# EAGLE design Controller (EAGLE 8.4.1)
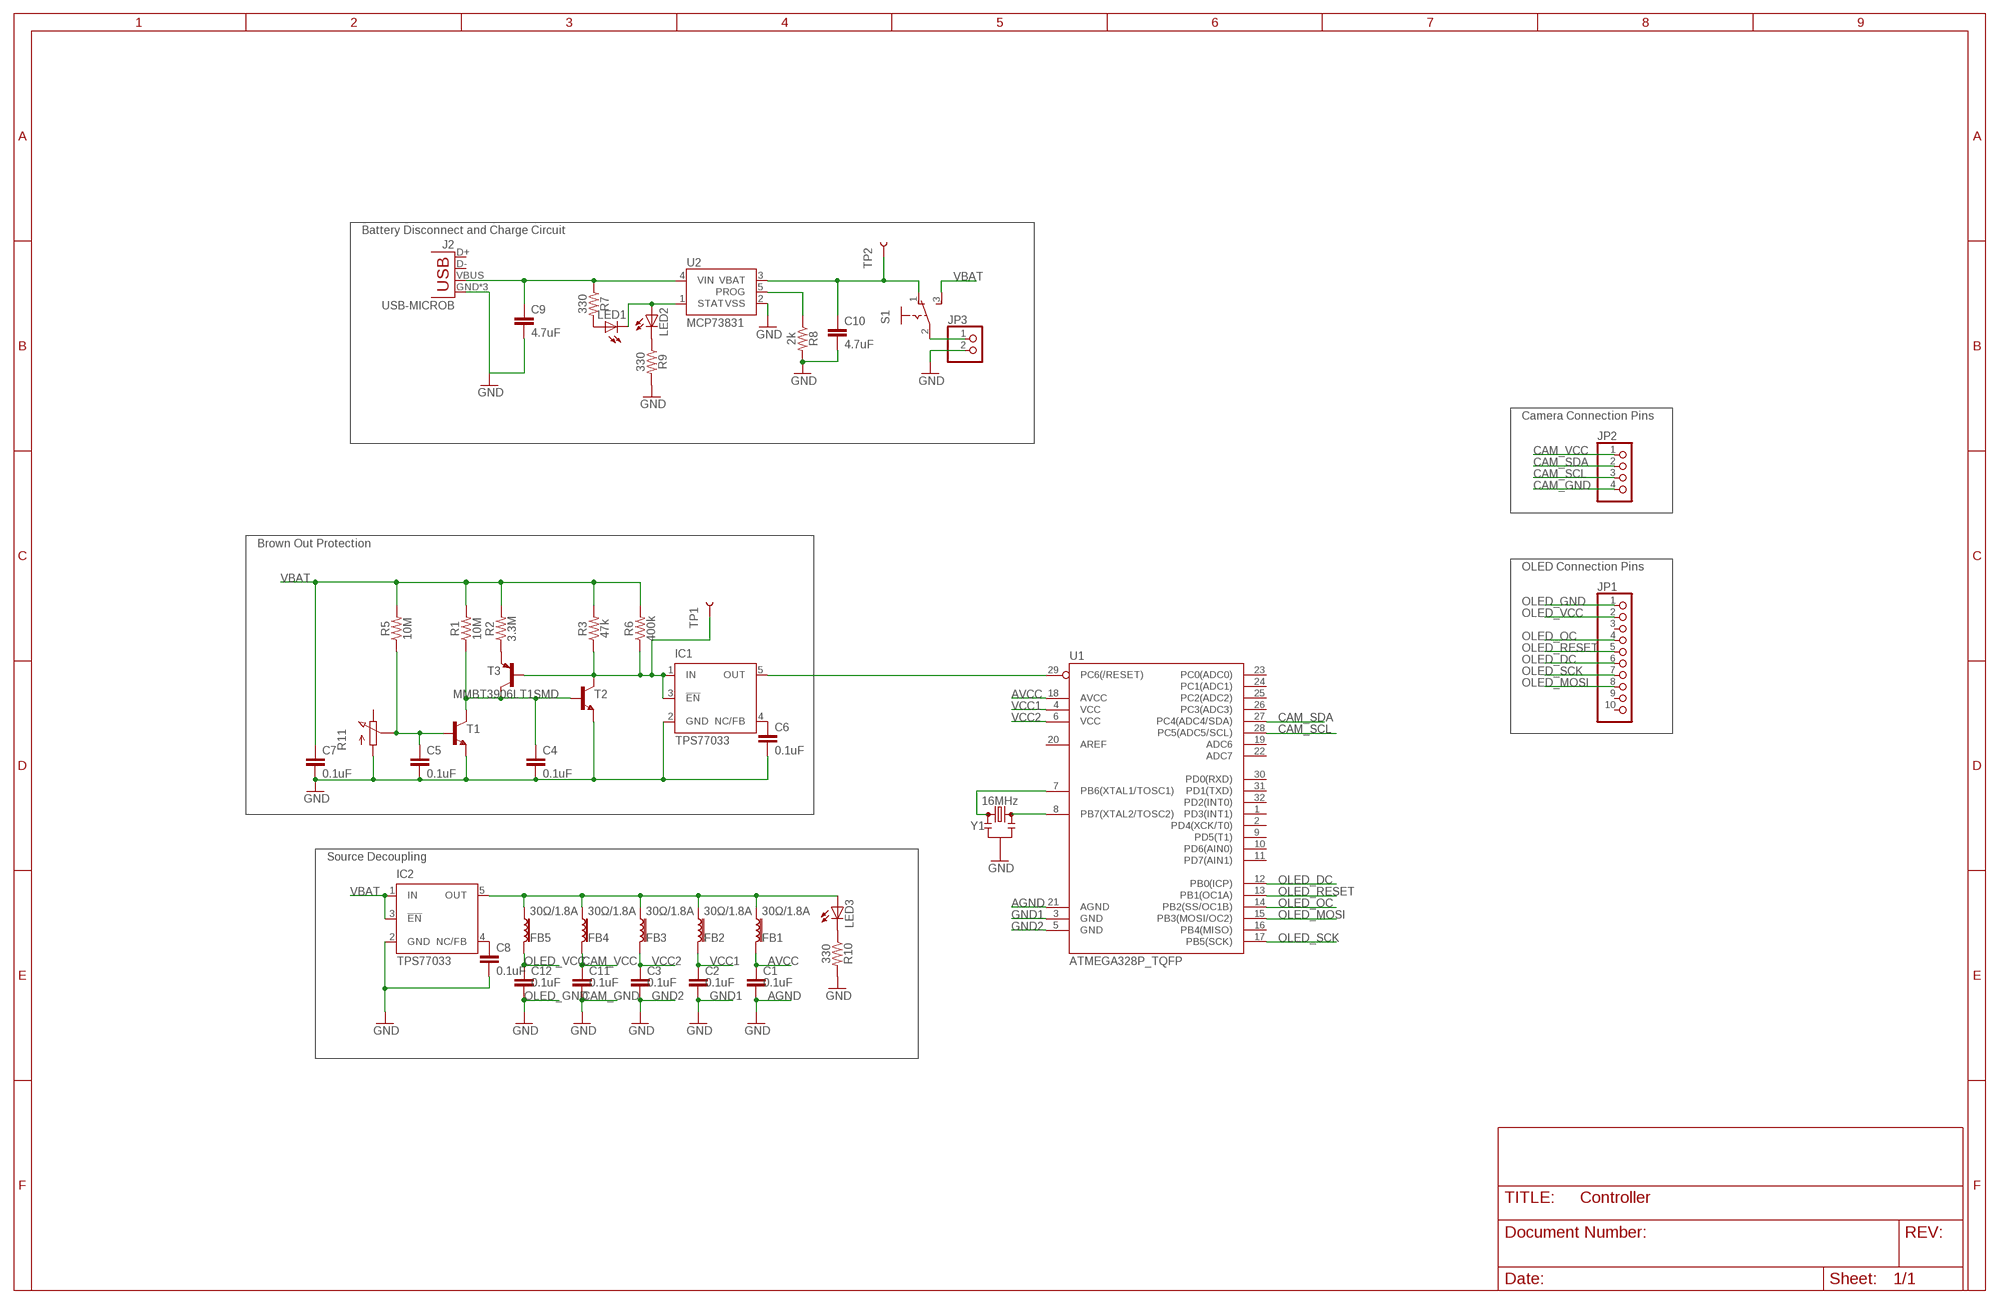
[diagram p0: schematic, sheet 1]

## Parts
C1  0.1uF  0.1UF-0603-25V-5%  [0603]
C2  0.1uF  0.1UF-0603-25V-5%  [0603]
C3  0.1uF  0.1UF-0603-25V-5%  [0603]
C4  0.1uF  0.1UF-0603-25V-5%  [0603]
C5  0.1uF  0.1UF-0603-25V-5%  [0603]
C6  0.1uF  0.1UF-0603-25V-5%  [0603]
C7  0.1uF  0.1UF-0603-25V-5%  [0603]
C8  0.1uF  0.1UF-0603-25V-5%  [0603]
C9  4.7uF  0.1UF-0603-25V-5%  [0603]
C10  4.7uF  0.1UF-0603-25V-5%  [0603]
C11  0.1uF  0.1UF-0603-25V-5%  [0603]
C12  0.1uF  0.1UF-0603-25V-5%  [0603]
FB1  30Ω/1.8A  FERRITE_BEAD-0603  [0603]
FB2  30Ω/1.8A  FERRITE_BEAD-0603  [0603]
FB3  30Ω/1.8A  FERRITE_BEAD-0603  [0603]
FB4  30Ω/1.8A  FERRITE_BEAD-0603  [0603]
FB5  30Ω/1.8A  FERRITE_BEAD-0603  [0603]
IC1  TPS77033  [SOT23-DBV]
IC2  TPS77033  [SOT23-DBV]
J2  USB-MICROB  [USB-MICROB]
JP1  PINHD-1X10/90  [1X10/90]
JP2  PINHD-1X4  [1X04]
JP3  PINHD-1X2/90  [1X02/90]
LED1  LS_T679-D2E2-1  [PLCC2]
LED2  LG_T679-E1F1-1  [PLCC2]
LED3  LG_T679-E1F1-1  [PLCC2]
R1  10M  10MOHM-0603-1/10W-5%  [0603]
R2  3.3M  10MOHM-0603-1/10W-5%  [0603]
R3  47k  10MOHM-0603-1/10W-5%  [0603]
R5  10M  10MOHM-0603-1/10W-5%  [0603]
R6  400k  10MOHM-0603-1/10W-5%  [0603]
R7  330  10MOHM-0603-1/10W-5%  [0603]
R8  2k  10MOHM-0603-1/10W-5%  [0603]
R9  330  10MOHM-0603-1/10W-5%  [0603]
R10  330  10MOHM-0603-1/10W-5%  [0603]
R11  PC25  [PC25]
S1  255SB  [255SB]
T1  MMBT3904LT1-NPN-SOT23-BEC  [SOT23-BEC]
T2  MMBT3904LT1-NPN-SOT23-BEC  [SOT23-BEC]
T3  MMBT3906LT1SMD  [SOT23-BEC]
TP1  TEST-POINT3X5  [PAD.03X.05]
TP2  TEST-POINT3X5  [PAD.03X.05]
U1  ATMEGA328P_TQFP  [TQFP32-08]
U2  MCP73831  [SOT23-5]
Y1  16MHz  RESONATOR-16MHZSMD_3.2X1.3  [RESONATOR-SMD-3.2X1.3]

## Nets
AGND: C1.2 U1.21(AGND) ; supply symbol labelled GND
AVCC: C1.1 FB1.2 U1.18(AVCC)
CAM_GND: C11.2 JP2.4 ; supply symbol labelled GND
CAM_SCL: JP2.3 U1.28(PC5(ADC5/SCL))
CAM_SDA: JP2.2 U1.27(PC4(ADC4/SDA))
CAM_VCC: C11.1 FB4.2 JP2.1
GND: C4.2 C5.2 C6.2 C7.2 C8.2 C9.2 C10.2 IC1.2(GND) IC2.2(GND) J2.GND J2.MT1(GND) J2.MT2(GND) JP3.2 R8.2 R9.2 R10.2 R11.A T1.E T2.E U2.2(VSS) Y1.2
GND1: C2.2 U1.3(GND) ; supply symbol labelled GND
GND2: C3.2 U1.5(GND) ; supply symbol labelled GND
LIPO_POS: JP3.1 S1.2(P)
N$1: IC1.1(IN) IC1.3(!EN) R3.1 R6.1 T2.C T3.B TP1.P$1
N$2: C5.1 R5.1 R11.S T1.B
N$3: IC1.5(OUT) U1.29(PC6(/RESET))
N$4: C4.1 R1.1 T1.C T2.B T3.C
N$5: R2.1 T3.E
N$6: LED1.C LED2.A U2.1(STAT)
N$7: C6.1 IC1.4(NC/FB)
N$8: FB1.1 FB2.1 FB3.1 FB4.1 FB5.1 IC2.5(OUT) LED3.A
N$9: C8.1 IC2.4(NC/FB)
N$10: LED1.A R7.2
N$11: C9.1 J2.VBUS R7.1 U2.4(VIN)
N$12: R8.1 U2.5(PROG)
N$13: C10.1 S1.1(O) TP2.P$1 U2.3(VBAT)
N$15: U1.7(PB6(XTAL1/TOSC1)) Y1.1
N$16: U1.8(PB7(XTAL2/TOSC2)) Y1.3
N$17: LED3.C R10.1
N$18: LED2.C R9.1
OLED_DC: JP1.6 U1.12(PB0(ICP))
OLED_GND: C12.2 JP1.1 ; supply symbol labelled GND
OLED_MOSI: JP1.8 U1.15(PB3(MOSI/OC2))
OLED_OC: JP1.4 U1.14(PB2(SS/OC1B))
OLED_RESET: JP1.5 U1.13(PB1(OC1A))
OLED_SCK: JP1.7 U1.17(PB5(SCK))
OLED_VCC: C12.1 FB5.2 JP1.2
VBAT: C7.1 IC2.1(IN) IC2.3(!EN) R1.2 R2.2 R3.2 R5.2 R6.2 S1.3(S)
VCC1: C2.1 FB2.2 U1.4(VCC)
VCC2: C3.1 FB3.2 U1.6(VCC)
Unconnected: J2.D+ J2.D- JP1.3 JP1.9 JP1.10 R11.E U1.1(PD3(INT1)) U1.2(PD4(XCK/T0)) U1.9(PD5(T1)) U1.10(PD6(AIN0)) U1.11(PD7(AIN1)) U1.16(PB4(MISO)) U1.19(ADC6) U1.20(AREF) U1.22(ADC7) U1.23(PC0(ADC0)) U1.24(PC1(ADC1)) U1.25(PC2(ADC2)) U1.26(PC3(ADC3)) U1.30(PD0(RXD)) U1.31(PD1(TXD)) U1.32(PD2(INT0))

## Notes on the sheet
- Battery Disconnect and Charge Circuit
- Camera Connection Pins
- Brown Out Protection
- OLED Connection Pins
- Source Decoupling

## Library data of the parts
C1-C8 C11 C12 = SparkFun-Capacitors:0.1UF: 0.1µF ceramic capacitors A capacitor is a passive two-terminal electrical component used to store electrical energy temporarily in an electric field.; PROD_ID: CAP-08604
C9 C10 = SparkFun-Capacitors:0.1UF: 0.1µF ceramic capacitors A capacitor is a passive two-terminal electrical component used to store electrical energy temporarily in an electric field.; PROD_ID: CAP-08604; VALUE: 0.1uF
FB1-FB5 = SparkFun-Coils:FERRITE_BEAD: Ferrite Bead (blocks, cores, rings, chokes, etc.) Inductor with layers of ferrite used to suppress high frequencies. Often used to isolate high frequency noise. SparkFun Products: IOIO-OTG - V2.2 <https://www.sparkfun.com/products/13613> SparkFun SAMD21 Mini Breakout <https://www.sparkfun.com/products/13664> SparkFun 6 Degrees of Freedom Breakout - LSM6DS3 <https://www.sparkfun.com/products/13339> SparkFun SAMD21 Dev Breakout <https://www.sparkfun.com/products/13672>; PROD_ID: NDUC-07859
IC1 IC2 = texas:TPS770*: ULTRALOW-POWER 50-mA LOW-DROPOUT LINEAR REGULATORS 50-mA Low-Dropout Regulator Source: http://focus.ti.com/lit/ds/symlink/tps77001.pdf; MF: TEXAS INSTRUMENTS; MPN: TPS77033DBVT; OC_FARNELL: 8461570; OC_NEWARK: 77C1187
J2 = SparkFun-Retired:USB: USB Connectors USB-B-PTH is fully proven SKU : PRT-00139/CONN-08278 USB-miniB is fully proven SKU : PRT-00587 USB-A-PCB is untested. USB-A-H is throughly reviewed, but untested. Spark Fun Electronics SKU : PRT-00437 USB-B-SMT is throughly reviewed, but untested. Needs silkscreen touching up. USB-A-S has not been used/tested USB-MB-H has not been used/tested USB-MICROB has been used. CONN-09505; PROD_ID: CONN-09505
JP1 = pinhead:PINHD-1X10: PIN HEADER
JP2 = pinhead:PINHD-1X4: PIN HEADER
JP3 = pinhead:PINHD-1X2: PIN HEADER
LED1 = led:*_T679-?-1: LC TOPLED® Low Current LED Source: http://catalog.osram-os.com .. LG_LS_LY_T679_OBS.pdf; COLOR: super-red
LED2 LED3 = led:*_T679-?-1: LC TOPLED® Low Current LED Source: http://catalog.osram-os.com .. LG_LS_LY_T679_OBS.pdf; COLOR: green
R1 R5 = SparkFun-Resistors:10MOHM: RES-09327; PROD_ID: RES-08283
R2 R3 R6-R10 = SparkFun-Resistors:10MOHM: RES-09327; PROD_ID: RES-08283; VALUE: 10M
R11 = pot-vitrohm:PC25: VITROHM POTENTIOMETER; MF: CLAROSTAT; MPN: 308NPC25KS; OC_FARNELL: 1440998; OC_NEWARK: 03F7518
S1 = switch:255SB: SLIDING SWITCH Distributor Buerklin, 11G810
T1 T2 = transistor-neu-to92:*-NPN-: NPN Transistror
T3 = transistor-pnp:MMBT3906*: PNP Transistror
TP1 TP2 = SparkFun-Connectors:TEST-POINT: SparkFun Test Points Bare copper test points for troubleshooting or In-Circuit-Testing. These are used by our Production team for verifying production board runs using pogo-pins on test beds. SparkFun Products: SparkFun LSM9DS1 Breakout <https://www.sparkfun.com/products/13284> SparkFun PSOC <https://www.sparkfun.com/products/13714> SparkFun Load Cell Amplifier <https://www.sparkfun.com/products/13879>
U1 = SparkFun-IC-Microcontroller:ATMEGA328P_TQFP: Popular 328P in QFP Storefront component: ATmega328 - TQFP <https://www.sparkfun.com/products/13448> (COM-13448) Datasheet <http://www.sparkfun.com/datasheets/Components/SMD/ATMega328.pdf> SparkFun Products SparkFun RedBoard - Programmed with Arduino <https://www.sparkfun.com/products/12757> (DEV-12757) Arduino Pro Mini 328 - 5V/16MHz <https://www.sparkfun.com/products/11113> (DEV-11113) Arduino Pro Mini 328 - 3.3V/8MHz <https://www.sparkfun.com/products/11114> (DEV-11114) SparkFun OpenLog <https://www.sparkfun.com/products/13712> (DEV-13712) SparkFun MicroView - OLED Arduino Module <https://www.sparkfun.com/products/12923> (DEV-12923) SparkFun Digital Sandbox <https://www.sparkfun.com/products/12651> (DEV-12651) SparkFun PicoBoard <https://www.sparkfun.com/products/11888> (WIG-11888) Arduino Fio <https://www.sparkfun.com/products/10116> (DEV-10116) LilyPad Arduino 328 Main Board <https://www.sparkfun.com/products/13342> (DEV-13342) SparkFun RedStick <https://www.sparkfun.com/products/13741> (DEV-13741) LilyPad MP3 <https://www.sparkfun.com/products/11013> (DEV-11013) LilyPad Arduino SimpleSnap <https://www.sparkfun.com/products/10941> (DEV-10941) SparkFun Stepoko <https://www.sparkfun.com/products/13899> (ROB-13899) SparkFun Geiger Counter <https://www.sparkfun.com/products/11345> (SEN-11345) SparkFun EL Sequencer <https://www.sparkfun.com/products/12781> (COM-12781) Arduino Pro 328 - 5V/16MHz <https://www.sparkfun.com/products/10915> (DEV-10915) CryptoCape <https://www.sparkfun.com/products/12773> (DEV-12773) SparkFun IR Thermometer Evaluation Board - MLX90614 <https://www.sparkfun.com/products/10740> (SEN-10740) SparkFun RedBot Mainboard <https://www.sparkfun.com/products/12097> (ROB-12097) Arduino Pro 328 - 3.3V/8MHz <https://www.sparkfun.com/products/10914> (DEV-10914) SparkFun Block for Intel® Edison - Arduino <https://www.sparkfun.com/products/13036> (DEV-13036) SparkFun Simon Says - Surface Mount Soldering Kit <https://www.sparkfun.com/products/10935> (KIT-10935) SparkFun 7-Segment Serial Display - Red <https://www.sparkfun.com/products/11441> (COM-11441) SparkFun 7-Segment Serial Display - White <https://www.sparkfun.com/products/11629> (COM-11629) SparkFun 7-Segment Serial Display - Yellow <https://www.sparkfun.com/products/11443> (COM-11443) SparkFun 7-Segment Serial Display - Kelly Green <https://www.sparkfun.com/products/11440> (COM-11440) SparkFun 7-Segment Serial Display - Blue <https://www.sparkfun.com/products/11442> (COM-11442) SparkFun OpenSegment Serial Display - 20mm (Blue) <https://www.sparkfun.com/products/11647> (COM-11647) SparkFun OpenSegment Serial Display - 20mm (Green) <https://www.sparkfun.com/products/11646> (COM-11646) SparkFun OpenSegment Serial Display - 20mm (White) <https://www.sparkfun.com/products/11648> (COM-11648) SparkFun OpenSegment Serial Display - 20mm (Red) <https://www.sparkfun.com/products/11644> (COM-11644) SparkFun OpenSegment Serial Display - 20mm (Yellow) <https://www.sparkfun.com/products/11645> (COM-11645) SparkFun OpenSegment Shield <https://www.sparkfun.com/products/13190> (DEV-13190); PROD_ID: IC-09069
U2 = SparkFun-IC-Power:MCP73831: MCP73831T Li-Ion, Li-Pol Controller Miniature single cell, fully integrated Li-Ion, Li-polymer charge management controller Datasheet <http://ww1.microchip.com/downloads/en/DeviceDoc/20001984g.pdf> SparkFun Products: SparkFun ESP32 Thing <https://www.sparkfun.com/products/13907> SparkFun 9DoF Razor IMU M0 <https://www.sparkfun.com/products/14001>; PROD_ID: IC-09995
Y1 = SparkFun-Clocks:RESONATOR-16MHZ: 16MHz Resonator Digikey Example <http://www.digikey.com/product-detail/en/murata-electronics-north-america/CSTCE16M0V53-R0/490-1198-1-ND/584635> Frequency: 16MHz Frequency Stability: ±0.3% Frequency Tolerance: ±0.5% Capacitance: 15pF SparkFun Products SparkFun OpenLog <https://www.sparkfun.com/products/13712> SparkFun MicroView - OLED Arduino Module <https://www.sparkfun.com/products/12923>; PROD_ID: XTAL-08900

## Board
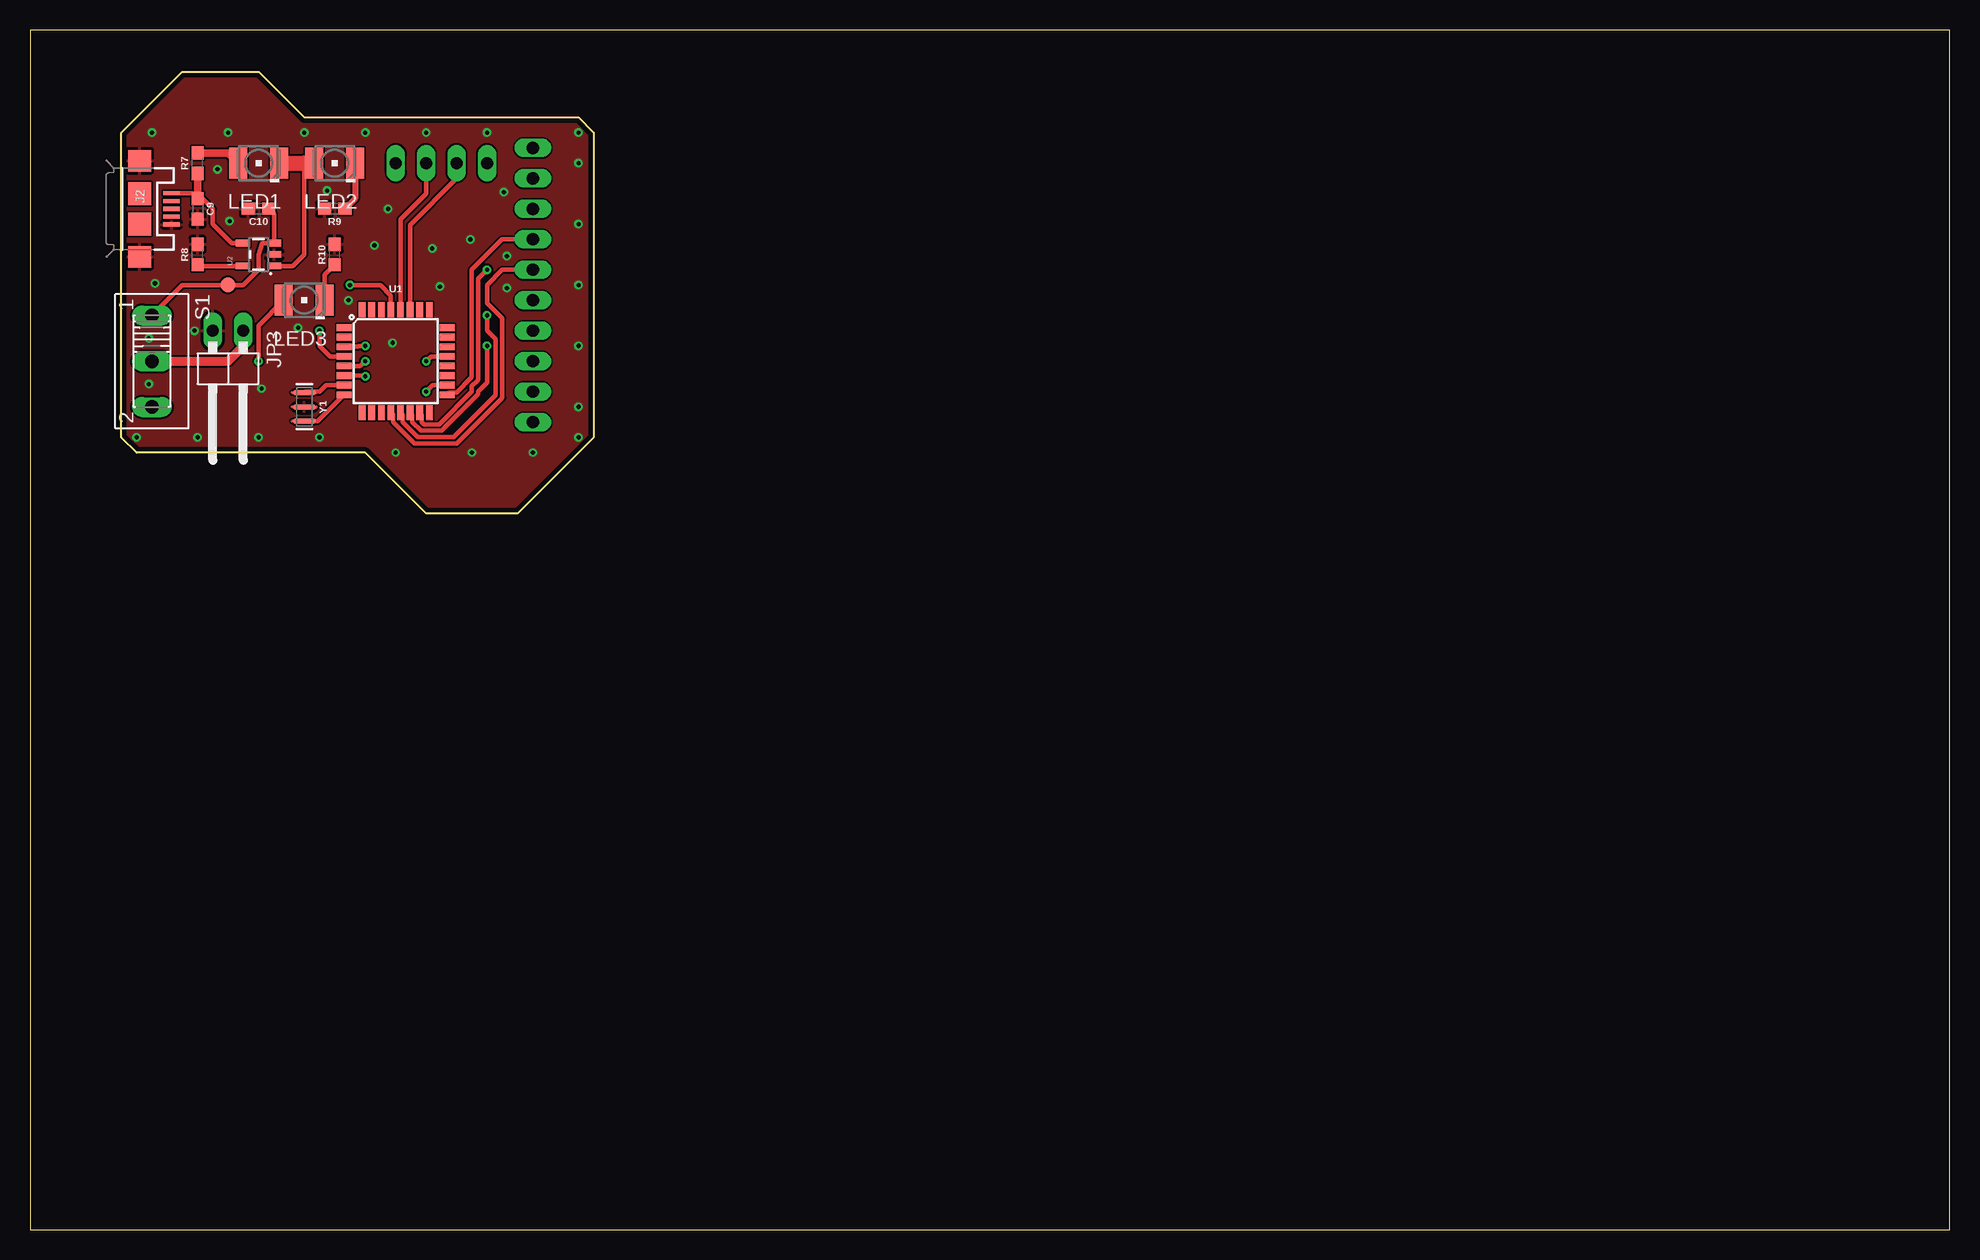
[diagram p1: board, top side]
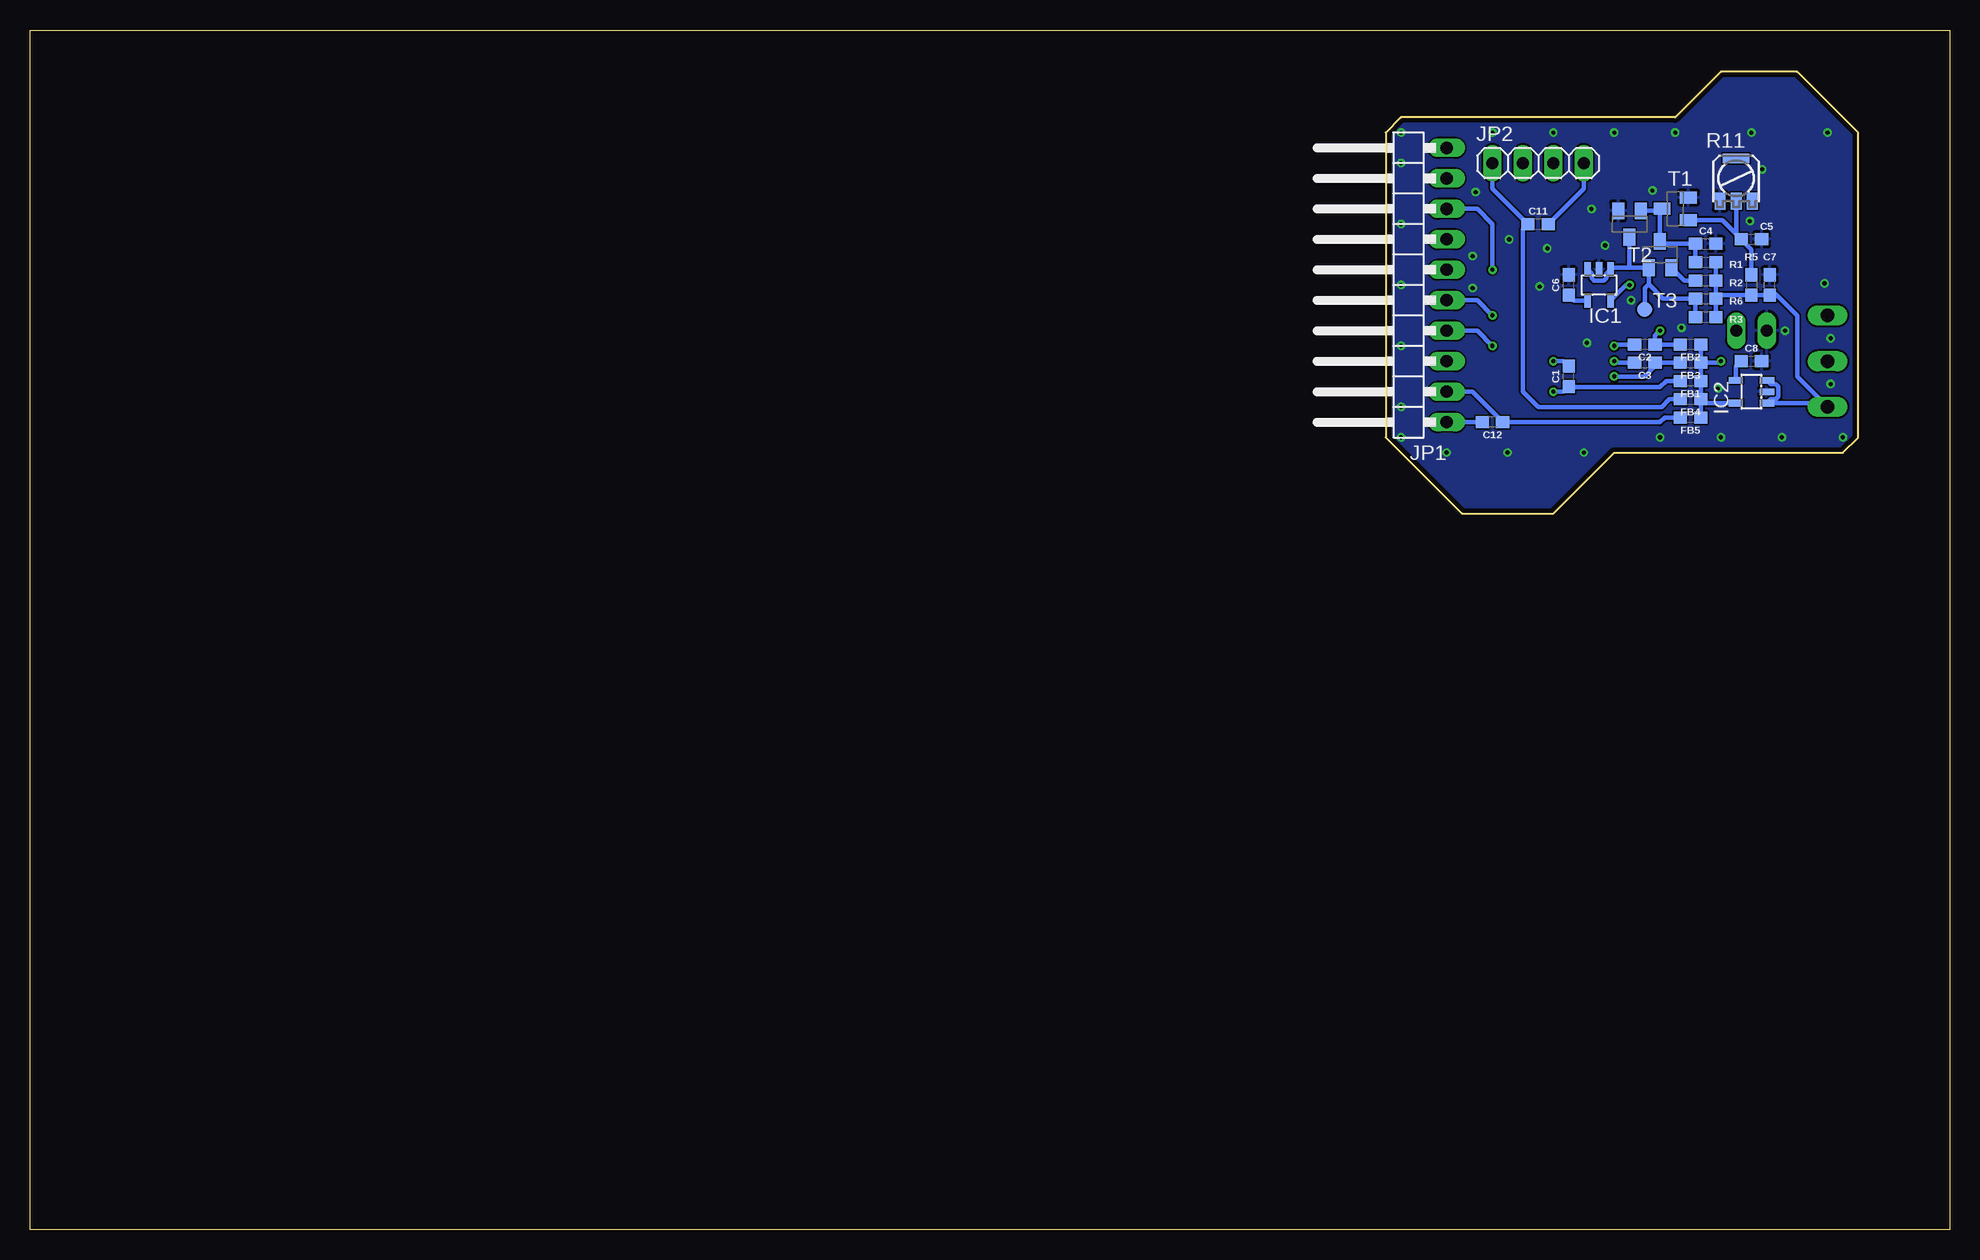
[diagram p2: board, bottom side, seen from below]

Size 160 x 100 mm. Coordinates in mm from the lower left corner, seen from the top.
Outline: 0,0 160,0 160,100 0,100 0,0
Outline: 7.62,91.44 12.7,96.52 19.05,96.52 22.86,92.71 45.72,92.71 46.99,91.44 46.99,66.04 40.64,59.69 33.02,59.69 27.94,64.77 8.89,64.77 7.62,66.04 7.62,91.44
Copper layers (1*16): Top 0.0356mm / dielectric 1.5011mm / Bottom 0.0356mm
Design rules "oshpark-2layer": minimum track width 6mil, minimum drill 13mil, track to track 6mil, track to pad 6mil, pad to pad 6mil, via to via 6mil, smd to smd 6mil, copper to edge 15mil, drill to drill 6mil, minimum pad ring 7mil, minimum via ring 7mil, stop-mask expansion 2.5mil, vias tented up to drill 0mil, thermal gap 10mil

### Footprints (pad centres in the part's own frame; a part is rotated, then mirrored left to right if it is on the bottom)
0603 = smd 1.1 x 1: 1 -0.85,0; 2 0.85,0
SOT23-DBV = smd 0.55 x 1.2: 1 -0.95,-1.3; 2 0,-1.3; 3 0.95,-1.3; 4 0.95,1.3; 5 -0.95,1.3
USB-MICROB = smd 0.35 x 1.4: D+ 0,2.65; D- -0.65,2.65; GND 1.3,2.65; ID 0.65,2.65; VBUS -1.3,2.65 | smd 1.8 x 1.9: MT1 -4,0; MT2 4,0 | smd 1.9 x 1.9: P$1 -1.27,0; P$2 1.27,0
1X10/90 = drill 1.016 long: 1 -11.43,-3.81; 2 -8.89,-3.81; 3 -6.35,-3.81; 4 -3.81,-3.81; 5 -1.27,-3.81; 6 1.27,-3.81; 7 3.81,-3.81; 8 6.35,-3.81; 9 8.89,-3.81; 10 11.43,-3.81
1X04 = drill 1.016 long: 1 -3.81,0; 2 -1.27,0; 3 1.27,0; 4 3.81,0
1X02/90 = drill 1.016 long: 1 -1.27,-3.81; 2 1.27,-3.81
PLCC2 = smd 2.6 x 1.5: A 0,1.7; C 0,-1.7
PC25 = smd 2.2 x 0.8: 4 0,1.65 | smd 0.9 x 1.4: A -1.35,-1.9; E 1.35,-1.9; S 0,-1.9
255SB = drill 1.118 long: 1 -3.81,0; 2 0,0; 3 3.81,0
SOT23-BEC = smd 1 x 1.4: B -0.95,-1.1; C 0,1.1; E 0.95,-1.1
PAD.03X.05 = smd 1.27 x 1.27: P$1 0,0
TQFP32-08 = smd 1.27 x 0.559: 1 -4.293,2.8; 2 -4.293,2; 3 -4.293,1.2; 4 -4.293,0.4; 5 -4.293,-0.4; 6 -4.293,-1.2; 7 -4.293,-2; 8 -4.293,-2.8; 17 4.293,-2.8; 18 4.293,-2; 19 4.293,-1.2; 20 4.293,-0.4; 21 4.293,0.4; 22 4.293,1.2; 23 4.293,2; 24 4.293,2.8 | smd 0.559 x 1.27: 9 -2.8,-4.293; 10 -2,-4.293; 11 -1.2,-4.293; 12 -0.4,-4.293; 13 0.4,-4.293; 14 1.2,-4.293; 15 2,-4.293; 16 2.8,-4.293; 25 2.8,4.293; 26 2,4.293; 27 1.2,4.293; 28 0.4,4.293; 29 -0.4,4.293; 30 -1.2,4.293; 31 -2,4.293; 32 -2.8,4.293
SOT23-5 = smd 0.55 x 1.2: 1 -0.95,-1.3; 2 0,-1.3; 3 0.95,-1.3; 4 0.95,1.3; 5 -0.95,1.3
RESONATOR-SMD-3.2X1.3 = smd 0.45 x 1.905: 1 -1.2,0; 2 0,0; 3 1.2,0

### Placement (x,y rotation side)
C1  31.75,71.12 90 bottom
C2  25.4,73.79 180 bottom
C3  25.4,72.26 180 bottom
C4  20.32,82.17 0 bottom
C5  16.51,82.55 0 bottom
C6  31.75,78.74 90 bottom
C7  14.99,78.74 90 bottom
C8  16.51,72.39 0 bottom
C9  13.97,85.09 270 top
C10  19.05,85.09 180 top
C11  34.29,83.82 0 bottom
C12  38.1,67.31 180 bottom
FB1  21.59,70.74 180 bottom
FB2  21.59,73.79 180 bottom
FB3  21.59,72.26 180 bottom
FB4  21.59,69.22 180 bottom
FB5  21.59,67.69 180 bottom
IC1  29.21,78.74 180 bottom
IC2  16.51,69.85 90 bottom
J2  9.14,85.09 270 top
JP1  45.72,78.74 90 bottom
JP2  34.29,88.9 0 bottom
JP3  16.51,71.12 180 top
LED1  19.05,88.9 90 top
LED2  25.4,88.9 90 top
LED3  22.86,77.47 90 top
R1  20.32,80.64 0 bottom
R2  20.32,79.12 0 bottom
R3  20.32,76.07 0 bottom
R5  16.51,78.74 270 bottom
R6  20.32,77.6 0 bottom
R7  13.97,88.9 90 top
R8  13.97,81.28 90 top
R9  25.4,85.09 180 top
R10  25.4,81.28 90 top
R11  17.78,87.63 0 bottom
S1  10.16,72.39 270 top
T1  22.86,85.09 90 bottom
T2  26.67,83.82 180 bottom
T3  24.13,81.28 0 bottom
TP1  25.4,76.71 0 bottom
TP2  16.51,78.74 0 top
U1  30.48,72.39 0 top
U2  19.05,81.28 90 top
Y1  22.86,68.58 270 top

### Tracks (layer width: path | path; a pad name or v marks a point on that pad's centre or on a via)
AGND  (via drill 0.35 pad 0.55)
  Top 0.381: v33.02,72.39 33.42,72.79 U1.21
  Bottom 0.381: C1.2 32.17,72.39 v33.02,72.39
AVCC  (via drill 0.35 pad 0.55)
  Top 0.381: U1.18 33.56,70.39 v33.02,69.85
  Bottom 0.381: v33.02,69.85 32.17,69.85 C1.1 31.71,70.23 24.13,70.23 23.62,70.74 FB1.2
CAM_GND
  Bottom 0.381: C11.2 30.48,86.78 JP2.4
CAM_SCL
  Top 0.381: U1.28 30.88,84.22 33.02,86.36 JP2.3
CAM_SDA
  Top 0.381: U1.27 31.68,83.75 35.56,87.63 JP2.2
CAM_VCC
  Bottom 0.381: JP2.1 38.1,86.78 C11.1 35.56,83.4 35.56,69.85 34.29,68.58 23.98,68.58 23.34,69.22 FB4.2
GND  (via drill 0.35)
  other vias: 10.16,91.44 16.51,91.44 22.86,91.44 27.94,91.44 33.02,91.44 38.1,91.44 45.72,91.44 45.72,88.9 45.72,83.82 45.72,78.74 45.72,73.66 45.72,68.58 45.72,66.04 41.91,64.77 36.83,64.77 30.48,64.77 24.13,66.04 19.05,66.04 13.97,66.04 8.89,66.04 9.91,70.48 9.91,74.3 10.41,78.87 16.64,84.07 15.62,88.39 29.84,85.09 28.7,82.04 33.53,81.79 34.16,78.61 30.23,73.91 36.7,82.55 39.75,81.15 39.75,78.49 39.5,86.49 24.77,86.61 19.3,70.1 13.72,74.93 26.54,77.47 22.35,75.18
  pour Bottom: 7.62,91.44 12.7,96.52 19.05,96.52 22.86,92.71 45.72,92.71 46.99,91.44 46.99,66.04 40.64,59.69 33.02,59.69 27.94,64.77 8.89,64.77 7.62,66.04
  pour Top: 7.62,91.44 12.7,96.52 19.05,96.52 22.86,92.71 45.72,92.71 46.99,91.44 46.99,66.04 40.64,59.69 33.02,59.69 27.94,64.77 26.67,64.77 8.89,64.77 7.62,66.04
GND1  (via drill 0.35)
  Top 0.152: 27.33,73.59 27.4,73.66
  Top 0.381: U1.3 27.33,73.59 | 27.4,73.66 v27.94,73.66
  Bottom 0.381: v27.94,73.66 27.81,73.79 C2.2
GND2  (via drill 0.35 pad 0.55)
  Top 0.381: v27.94,72.39 27.54,71.99 U1.5
  Bottom 0.381: v27.94,72.39 27.81,72.26 C3.2
LIPO_POS
  Top 0.762: S1.2 16.51,72.39 17.78,73.66 JP3.1
N$1
  Bottom 0.381: R3.1 R6.1 23.88,77.6 25.08,78.8 | IC1.3 29.83,79.71 29.83,79.3 29.63,79.1 28.79,79.1 28.59,79.3 28.59,79.71 IC1.1 28.12,80.18 26.67,80.18 | 26.67,80.18 T3.B 25.08,78.8 | 26.67,80.18 T2.C | 25.08,78.8 25.4,78.48 TP1.P$1
N$2
  Bottom 0.381: C5.1 17.78,82.97 R11.S | C5.1 17.68,82.87 | C5.1 16.51,81.7 R5.1 | C5.1 18.2,83.39 | 18.2,83.39 18.23,83.42 | 18.2,83.39 18.95,84.14 T1.B
N$3  (via drill 0.35 pad 0.55)
  Top 0.381: v26.67,78.74 29.21,78.74 30.08,77.87 U1.29
  Bottom 0.381: IC1.5 26.96,78.74 v26.67,78.74
N$4
  Bottom 0.381: R1.1 C4.1 23.92,82.17 T3.C 24.13,84.92 | T2.B 24.13,84.92 | T1.C 24.13,84.92
N$5
  Bottom 0.381: R2.1 22.12,79.12 T3.E
N$6
  Top 0.152: 22.86,88.9 LED2.A
  Top 0.381: 22.86,88.9 22.86,81.28 21.91,80.33 U2.1
  Top 1.27: LED1.C 22.86,88.9
N$7
  Bottom 0.381: C6.1 31.3,77.44 IC1.4
N$8  (via drill 0.35)
  Top 0.381: v19.05,72.39 19.05,75.36 LED3.A
  Bottom 0.381: FB4.1 FB1.1 FB3.1 | FB4.1 FB5.1 | FB2.1 FB3.1 | FB4.1 20.43,68.9 IC2.5 | FB3.1 19.18,72.26 v19.05,72.39
N$9
  Bottom 0.381: C8.1 17.81,71.94 IC2.4
N$10
  Top 0.635: R7.2 16.5,89.75 LED1.A
N$11
  Top 0.381: U2.4 16.83,82.23 15.24,83.82 15.24,85.09 13.97,86.36 C9.1 13.52,86.39 J2.VBUS
  Top 0.635: 13.97,86.36 R7.1
N$12
  Top 0.152: 14.07,80.33 R8.1
  Top 0.381: U2.5 14.07,80.33
N$13
  Top 0.381: C10.1 20.35,84.64 U2.3 19.37,82.23 19.05,81.28 19.05,80.01 17.78,78.74 TP2.P$1 12.7,78.74 S1.1
N$15
  Top 0.381: Y1.1 22.93,69.85 24.13,69.85 24.67,70.39 U1.7
N$16
  Top 0.381: Y1.3 23.98,67.38 U1.8
N$17
  Top 0.381: LED3.C 24.56,79.59 R10.1
N$18
  Top 0.508: LED2.C 27.1,85.94 R9.1
OLED_DC
  Top 0.381: U1.12 30.26,67.92 30.26,67.32 32.06,65.52 35.54,65.52 39.35,69.33 39.35,75.97 38.1,77.22 38.1,78.74 39.37,80.01 JP1.6
OLED_GND
  Bottom 0.381: C12.2 JP1.1
OLED_MOSI  (via drill 0.35 pad 0.55)
  Top 0.381: U1.15 32.66,67.92 32.66,67.32 32.86,67.12 34.1,67.12 36.83,69.85 36.83,70.29 37.36,70.83 37.36,79.27 v38.1,80.01
  Bottom 0.381: v38.1,80.01 38.1,83.82 39.37,85.09 JP1.8
OLED_OC  (via drill 0.35 pad 0.55)
  Top 0.381: U1.14 31.86,67.92 31.86,67.32 32.59,66.59 34.32,66.59 37.36,69.63 37.36,69.85 38.1,70.59 v38.1,73.66
  Bottom 0.381: v38.1,73.66 39.37,74.93 JP1.4
OLED_RESET  (via drill 0.35 pad 0.55)
  Top 0.381: U1.13 31.06,67.92 31.06,67.32 32.33,66.05 35.32,66.05 38.82,69.55 38.82,74.21 38.1,74.93 v38.1,76.2
  Bottom 0.381: v38.1,76.2 39.37,77.47 JP1.5
OLED_SCK
  Top 0.381: U1.17 34.95,69.77 35.55,69.77 36.83,71.05 36.83,80.01 39.37,82.55 JP1.7
OLED_VCC
  Bottom 0.381: JP1.2 39.79,69.85 C12.1 24.13,67.31 23.75,67.69 FB5.2
VBAT
  Bottom 0.381: R1.2 R2.2 R6.2 | R6.2 R3.2 | R6.2 19.05,77.89 R5.2 C7.1 14.57,77.89 14.48,77.98 12.7,76.2 12.7,71.12 S1.3 10.48,68.9 IC2.1 14.88,69.23 14.47,69.23 14.27,69.43 14.27,70.27 14.47,70.47 14.88,70.47 IC2.3
VCC1  (via drill 0.35 pad 0.55)
  Top 0.381: U1.4 25,72.79 24.13,73.66 v24.13,74.93
  Bottom 0.381: 24.55,74.51 v24.13,74.93 24.55,74.51 | FB2.2 C2.1 24.55,74.51
VCC2  (via drill 0.35 pad 0.55)
  Top 0.381: U1.6 27.87,71.19 v27.94,71.12
  Bottom 0.381: v27.94,71.12 25.4,71.12 24.55,71.97 C3.1 FB3.2